# Altium schematic sheet StrontiumUHV.SchDoc
size A
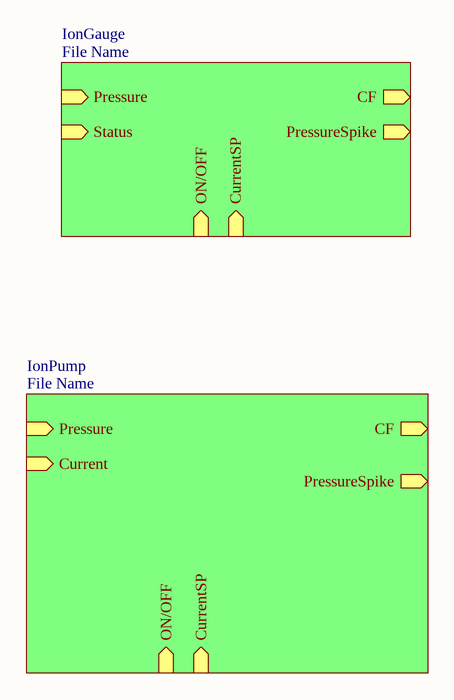
[diagram p0: StrontiumUHV.SchDoc]

## Sub-sheets
IonGauge = File Name: Pressure (in), Status (in), CF (out), PressureSpike (out), ON/OFF (in), CurrentSP (in)
IonPump = File Name: Pressure (in), CurrentSP (in), CF (out), Current (in), ON/OFF (in), PressureSpike (out)